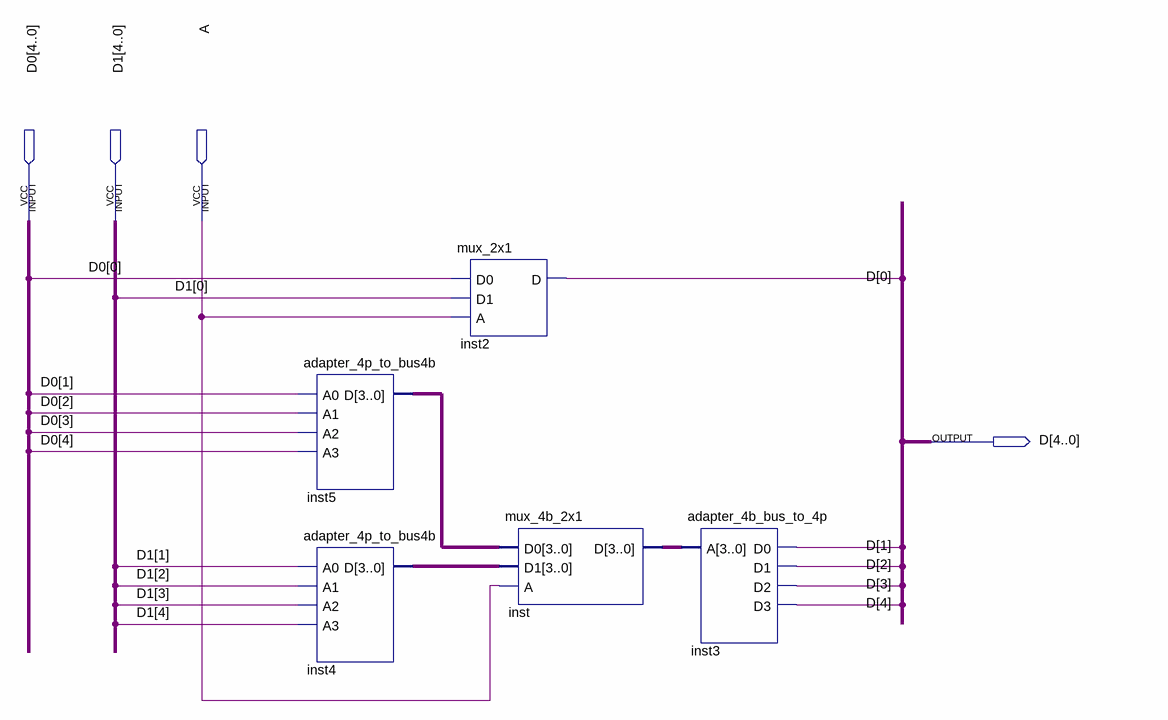
[diagram p0: schematic sheet]
// Quartus schematic mux_5b_2x1.bdf as structural Verilog: 5 symbols, 4 pins
module mux_5b_2x1 (
  input  [4:0] D0,
  input  [4:0] D1,
  input  A,
  output [4:0] D
);

  wire [3:0] inst4_d, inst5_d, inst_d;

  adapter_4p_to_bus4b inst5 (.A0(D0[1]), .A1(D0[2]), .A2(D0[3]), .A3(D0[4]), .D(inst5_d));
  adapter_4p_to_bus4b inst4 (.A0(D1[1]), .A1(D1[2]), .A2(D1[3]), .A3(D1[4]), .D(inst4_d));
  mux_2x1 inst2 (.D0(D0[0]), .D1(D1[0]), .A(A), .D(D[0]));
  mux_4b_2x1 inst (.D0(inst5_d), .D1(inst4_d), .A(A), .D(inst_d));
  adapter_4b_bus_to_4p inst3 (.A(inst_d), .D0(D[1]), .D1(D[2]), .D2(D[3]), .D3(D[4]));
endmodule
